# EasyEDA schematic SCH_connector_V1.0_2024-03-04.json
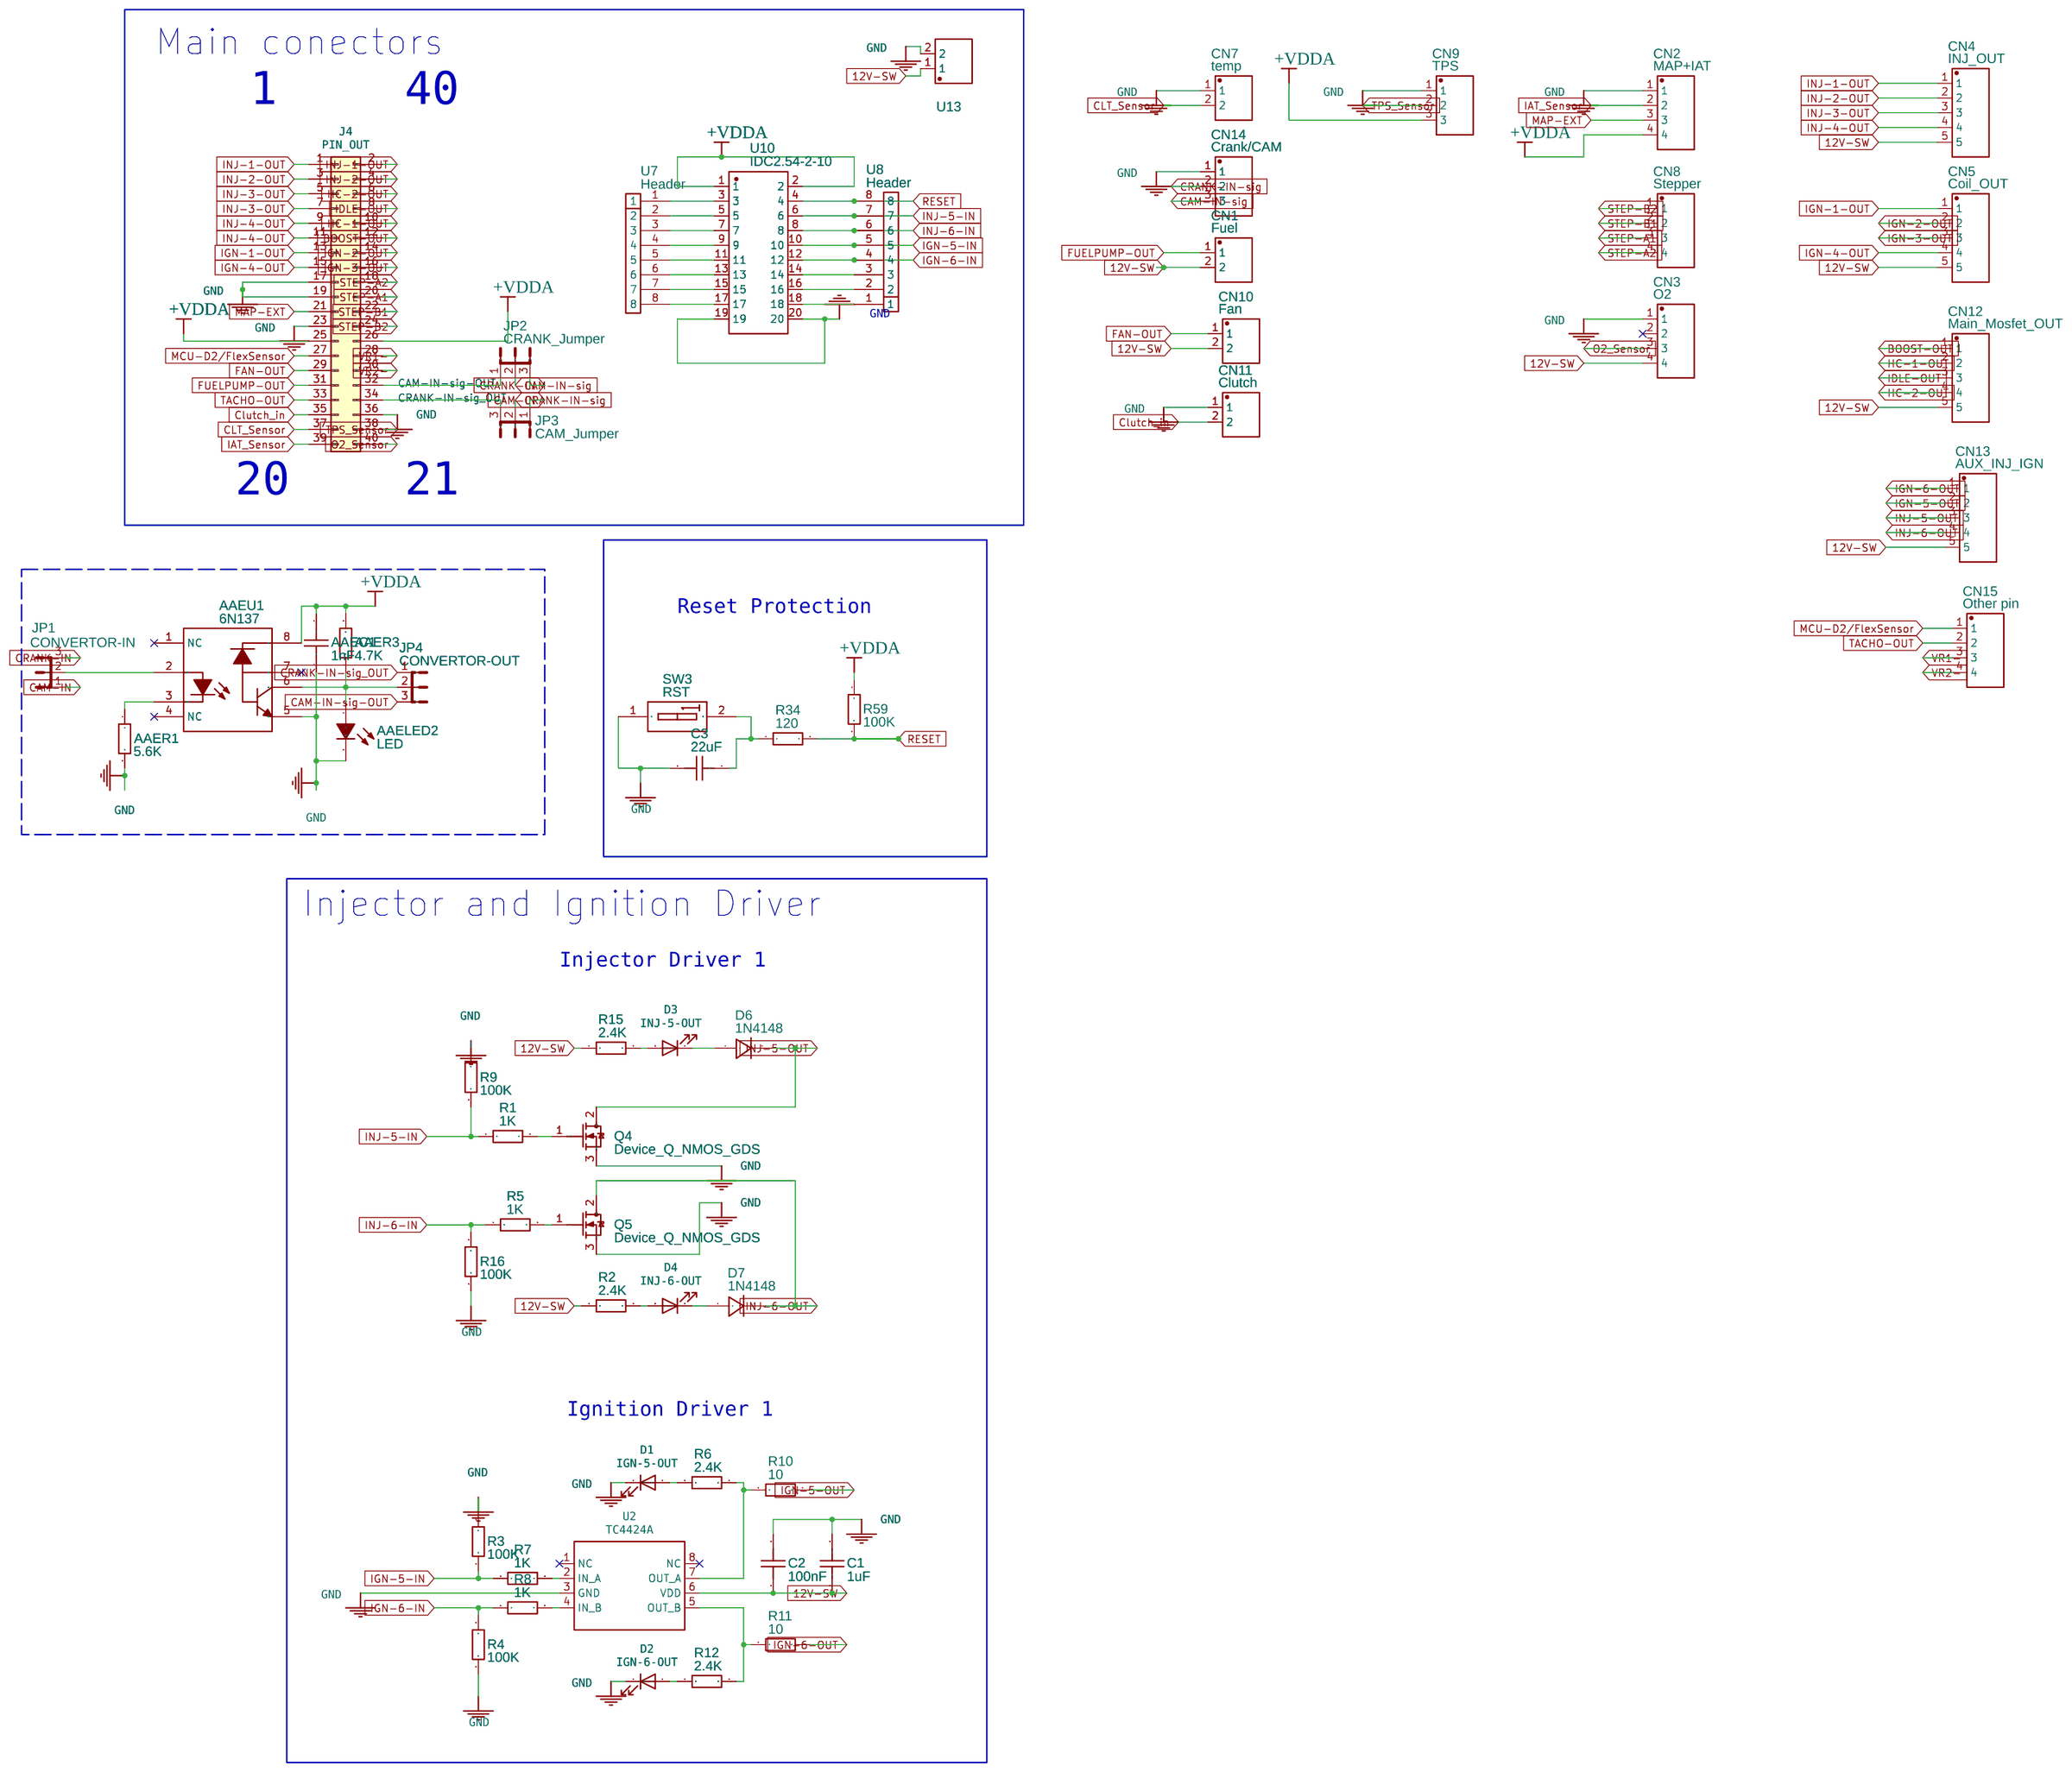
[diagram p0: schematic sheet]

## Parts
AAEC1  1nF  [C0805]
AAELED2  LED  [LED0805-R-RD]
AAER1  5.6K  [R0805]
AAER3  4.7K  [R0805]
AAEU1  6N137  [DIP-8_L9.7-W6.4-P2.54-LS7.6-BL]
C1  1uF  [C0805]
C2  100nF  [C0805]
C3  22uF  [C0805]
CN1  Fuel  [PHONIX 2PIN (5.08MM)]
CN2  MAP+IAT  [PHONIX 4PIN (5.08MM)]
CN3  O2  [PHONIX 4PIN (5.08MM)]
CN4  INJ_OUT  [PHONIX 5PIN (5.08MM)]
CN5  Coil_OUT  [PHONIX 5PIN (5.08MM)]
CN7  temp  [PHONIX 2PIN (5.08MM)]
CN8  Stepper  [PHONIX 4PIN (5.08MM)]
CN9  TPS  [PHONIX 3PIN (5.08MM)]
CN10  Fan  [PHONIX 2PIN (5.08MM)]
CN11  Clutch  [PHONIX 2PIN (5.08MM)]
CN12  Main_Mosfet_OUT  [PHONIX 5PIN (5.08MM)]
CN13  AUX_INJ_IGN  [PHONIX 5PIN (5.08MM)]
CN14  Crank/CAM  [PHONIX 3PIN (5.08MM)]
CN15  Other pin  [PHONIX 4PIN (5.08MM)]
D1  IGN-5-OUT  [LED0805_RED]
D2  IGN-6-OUT  [LED0805_RED]
D3  INJ-5-OUT  [LED0805_RED]
D4  INJ-6-OUT  [LED0805_RED]
D6  1N4148  [SOD-323_L1.8-W1.3-LS2.5-RD]
D7  1N4148  [SOD-323_L1.8-W1.3-LS2.5-RD]
J4  PIN_OUT  [IDC-HEADER_2X20_P2.54MM_VERTICAL]
JP1  CONVERTOR-IN  [JUMPER 3X1 (PIN= 2.54)]
JP2  CRANK_Jumper  [JUMPER 3X1 (PIN= 2.54)]
JP3  CAM_Jumper  [JUMPER 3X1 (PIN= 2.54)]
JP4  CONVERTOR-OUT  [JUMPER 3X1 (PIN= 2.54)]
Q4  Device_Q_NMOS_GDS  [TO-220_Q_NMOS_GDS]
Q5  Device_Q_NMOS_GDS  [TO-220_Q_NMOS_GDS]
R1  1K  [R0805]
R2  2.4K  [R0805]
R3  100K  [R0805]
R4  100K  [R0805]
R5  1K  [R0805]
R6  2.4K  [R0805]
R7  1K  [R0805]
R8  1K  [R0805]
R9  100K  [R0805]
R10  10  [R0805]
R11  10  [R0805]
R12  2.4K  [R0805]
R15  2.4K  [R0805]
R16  100K  [R0805]
R34  120  [R0805]
R59  100K  [R0805]
SW3  RST  [SW-SMD_L5.4-W2.8-LS8.2]
U2  TC4424A  [SOIC-8_3.9X4.9MM_P1.27MM]
U7  Header  [1X8 HEADER (PIN = 2.54)]
U8  Header  [1X8 HEADER (PIN = 2.54)]
U10  IDC2.54-2-10  [IDC-TH_20P-P2.54_ZX-IDC2.54-2-10PZZ]
U13  Power Input  [PHONIX 2PIN (5.08MM)]

## Library data of the parts
AAEC1 = CC0805KRX7RBBB222: Supplier: LCSC; Supplier Part: C326760; Manufacturer: YAGEO; Contributor: LCSC
AAELED2 = 17-215/G6C-BM1N2L/3T: Supplier: LCSC; Supplier Part: C94615; Manufacturer: Everlight Elec; Contributor: LCSC
AAER1 AAER3 R1-R12 R15 R16 R34 R59 = RC0805FR-072K74L: Supplier: LCSC; Manufacturer: YAGEO; Supplier Part: C137554; JLCPCB Part Class: Extended Part
AAEU1 = 6N135: Supplier: LCSC; Manufacturer: FAIRCHILD; Supplier Part: C4070; JLCPCB Part Class: Extended Part
C1-C3 = 08051C105KAT2A: Contributor: LCSC; Supplier: LCSC; Supplier Part: C597292; Manufacturer: Kyocera AVX; JLCPCB Part Class: Extended Part
CN1 CN7 CN10 CN11 U13 = PHONIX 2PIN (5.08mm): Supplier Part: C8883; Manufacturer: ReliaPro; Manufacturer Part: PH-12AW; Contributor: amir slz
CN2 CN3 CN8 CN15 = PHONIX 4PIN (5.08mm): Supplier Part: C8883; Supplier: LCSC; Manufacturer: ReliaPro; Manufacturer Part: PH-12AW; Contributor: amir slz
CN4 CN5 CN12 CN13 = PHONIX 5PIN (5.08mm): Supplier Part: C8883; Supplier: LCSC; Manufacturer: ReliaPro; Manufacturer Part: PH-12AW; Contributor: amir slz
CN9 CN14 = PHONIX 3PIN (5.08mm): Supplier Part: C8883; Supplier: LCSC; Manufacturer: ReliaPro; Manufacturer Part: PH-12AW; Contributor: amir slz
D1-D4 = -: Digikey Part Number: 475-1415-1-ND; Manufacturer_Name: Osram; Manufacturer_Part_Number: LH R974-LP-1; URL: https://www.digikey.com/product-detail/en/osram-opto-semiconductors-inc/LH-R974-LP-1/475-1415-1-ND/1802604
D6 D7 = 1N4448HWSQ-7-F: Contributor: LCSC; Supplier: LCSC; Supplier Part: C526202; Manufacturer: DIODES(美台); JLCPCB Part Class: Extended Part
JP1-JP4 = JUMPER 3X1 (PIN= 2.54): Jumper 2 Pin; Contributor: amir slz; sourceId: neOM8uspn
Q4 Q5 = Device_Q_NMOS_GDS: Contributor: amir slz
SW3 = BDSWITCH-2PIN-1CH-1R27-SMD-V: Supplier: LCSC; Supplier Part: C9900022896; Manufacturer: null; Manufacturer Part: BDSwitch-2pin-1CH-1r27-SMD-V; JLCPCB Part Class: Extended Part; Contributor: lcsc
U2 = -: Digikey Part Number: 212-IXDN602SIACT-ND; Manufacturer_Name: IXYS; Manufacturer_Part_Number: IXDN602SIATR; URL: https://www.digikey.com/en/products/detail/ixys-integrated-circuits-division/IXDN602SIATR/2424695
U7 U8 = 1X8 Header (Pin = 2.54): Manufacturer Part: Male Header 2 pin; Contributor: amir slz
U10 = ZX-IDC2.54-2-10PZZ: Supplier: LCSC; Supplier Part: C7501245; Manufacturer: Megastar(兆星); Contributor: lcsc; JLCPCB Part Class: Extended Part

## Nets
12V-SW: C1.1 C2.1 CN1.2 CN3.4 CN4.5 CN5.5 CN10.2 CN12.5 CN13.5 R2.1 R15.1 U2.6(VDD) U13.1
+VDDA: AAEC1.1 AAER3.2 AAEU1.8 CN2.4 CN9.3 J4.25(Pin) J4.26(Pin) R59.1 U10.1 U10.2
GND: AAEC1.2 AAELED2.2(C) AAER1.2 AAEU1.5 C1.2 C2.2 C3.2 CN2.1 CN3.1 CN7.1 CN9.1 CN11.1 CN14.1 D1.1(K) D2.1(K) J4.17(Pin) J4.19(Pin) J4.23(Pin) J4.36(Pin) Q4.3(S) Q5.3(S) R3.1 R4.2 R9.1 R16.2 SW3.1(A1) U2.3(GND) U10.19 U10.20 U13.2
BOOST-OUT: CN12.1 J4.12(Pin)
CAM-IN: JP1.1 JP3.1
CAM-IN-sig: CN14.3 JP2.2
CAM-IN-sig-OUT: J4.32(Pin) JP2.1 JP4.3
CLT_Sensor: CN7.2 J4.37(Pin)
Clutch_in: CN11.2 J4.35(Pin)
CRANK-IN: JP1.3 JP2.3
CRANK-IN-sig: CN14.2 JP3.2
CRANK-IN-sig_OUT: J4.34(Pin) JP3.3 JP4.1
FAN-OUT: CN10.1 J4.29(Pin)
FUELPUMP-OUT: CN1.1 J4.31(Pin)
HC-1-OUT: CN12.2 J4.10(Pin)
HC-2-OUT: CN12.4 J4.6(Pin)
IAT_Sensor: CN2.2 J4.39(Pin)
IDLE-OUT: CN12.3 J4.8(Pin)
IGN-1-OUT: CN5.1 J4.13(Pin)
IGN-2-OUT: CN5.2 J4.14(Pin)
IGN-3-OUT: CN5.3 J4.16(Pin)
IGN-4-OUT: CN5.4 J4.15(Pin)
IGN-5-IN: R3.2 R7.1 U8.5 U10.10
IGN-5-OUT: CN13.2 R10.1
IGN-6-IN: R4.1 R8.1 U8.4 U10.12
IGN-6-OUT: CN13.1 R11.1
INJ-1-OUT: CN4.1 J4.1(Pin) J4.2(Pin)
INJ-2-OUT: CN4.2 J4.3(Pin) J4.4(Pin)
INJ-3-OUT: CN4.3 J4.5(Pin) J4.7(Pin)
INJ-4-OUT: CN4.4 J4.9(Pin) J4.11(Pin)
INJ-5-IN: R1.1 R9.2 U8.7 U10.6
INJ-5-OUT: CN13.3 D6.2(C) Q4.2(D)
INJ-6-IN: R5.1 R16.1 U8.6 U10.8
INJ-6-OUT: CN13.4 D7.2(C) Q5.2(D)
MAP-EXT: CN2.3 J4.21(Pin)
MCU-D2/FlexSensor: CN15.1 J4.27(Pin)
O2_Sensor: CN3.3 J4.40(Pin)
RESET: R34.2 R59.2 U8.8 U10.4
STEP-A1: CN8.3 J4.20(Pin)
STEP-A2: CN8.4 J4.18(Pin)
STEP-B1: CN8.2 J4.22(Pin)
STEP-B2: CN8.1 J4.24(Pin)
TACHO-OUT: CN15.2 J4.33(Pin)
TPS_Sensor: CN9.2 J4.38(Pin)
VR1-: CN15.3 J4.28(Pin)
VR2-: CN15.4 J4.30(Pin)
Net-(AAELED2-1): AAELED2.1(A) AAER3.1 AAEU1.6 JP4.2
Net-(AAER1-1): AAER1.1 AAEU1.3
Net-(AAEU1-2): AAEU1.2 JP1.2
Net-(C3-1): C3.1 R34.1 SW3.2(B1)
Net-(D1-2): D1.2(A) R6.1
Net-(D2-2): D2.2(A) R12.1
Net-(D3-1): D3.1(K) D6.1(A)
Net-(D3-2): D3.2(A) R15.2
Net-(D4-1): D4.1(K) D7.1(A)
Net-(D4-2): D4.2(A) R2.2
Net-(Q4-1): Q4.1(G) R1.2
Net-(Q5-1): Q5.1(G) R5.2
Net-(R6-2): R6.2 R10.2 U2.7(OUT_A)
Net-(R7-2): R7.2 U2.2(IN_A)
Net-(R8-2): R8.2 U2.4(IN_B)
Net-(R11-2): R11.2 R12.2 U2.5(OUT_B)
Net-(U7-1): U7.1 U10.3
Net-(U7-2): U7.2 U10.5
Net-(U7-3): U7.3 U10.7
Net-(U7-4): U7.4 U10.9
Net-(U7-5): U7.5 U10.11
Net-(U7-6): U7.6 U10.13
Net-(U7-7): U7.7 U10.15
Net-(U7-8): U7.8 U10.17
Net-(U8-1): U8.1 U10.18
Net-(U8-2): U8.2 U10.16
Net-(U8-3): U8.3 U10.14

Not connected (* = marked no-connect by the designer): AAEU1 1(NC)* 4(NC)* 7*; CN3 2*; U2 1(NC)* 8(NC)*

## Notes on the sheet
- Main conectors
- 1
- 40
- 20
- 21
- Reset Protection
- Injector and Ignition Driver
- Injector Driver 1
- Ignition Driver 1
